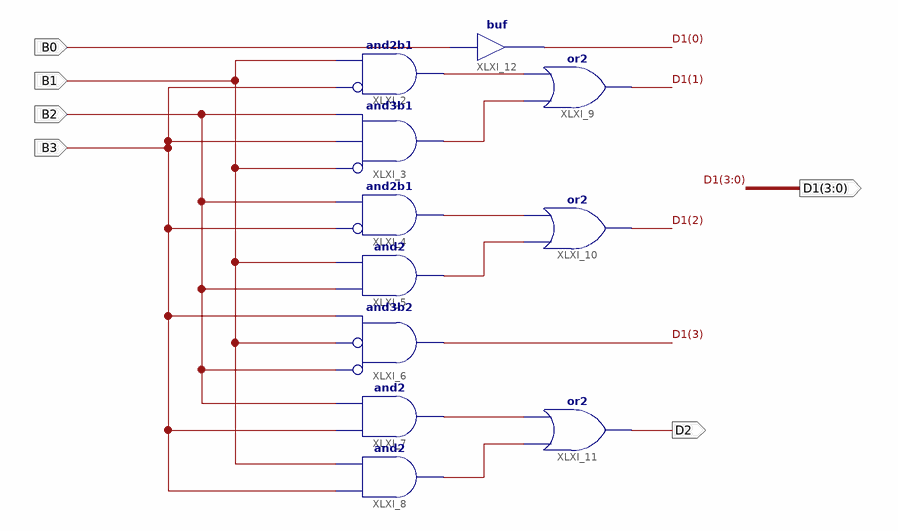
[diagram p0: schematic sheet 1]
// Xilinx ISE schematic bin2bcd.sch (spartan3e) as structural Verilog: 11 symbols, 6 ports
module bin2bcd (
  input  B1,
  input  B2,
  input  B3,
  input  B0,
  output D2,
  output [3:0] D1
);

  wire XLXN_11, XLXN_12, XLXN_13, XLXN_14, XLXN_15, XLXN_16;

  and XLXI_2 (XLXN_16, ~B3, B1);  // and2b1
  and XLXI_3 (XLXN_15, ~B1, B3, B2);  // and3b1
  and XLXI_4 (XLXN_14, ~B3, B2);  // and2b1
  and XLXI_5 (XLXN_13, B2, B1);
  and XLXI_6 (D1[3], ~B2, ~B1, B3);  // and3b2
  and XLXI_7 (XLXN_12, B3, B2);
  and XLXI_8 (XLXN_11, B3, B1);
  or XLXI_9 (D1[1], XLXN_15, XLXN_16);
  or XLXI_10 (D1[2], XLXN_13, XLXN_14);
  or XLXI_11 (D2, XLXN_11, XLXN_12);
  buf XLXI_12 (D1[0], B0);
endmodule
